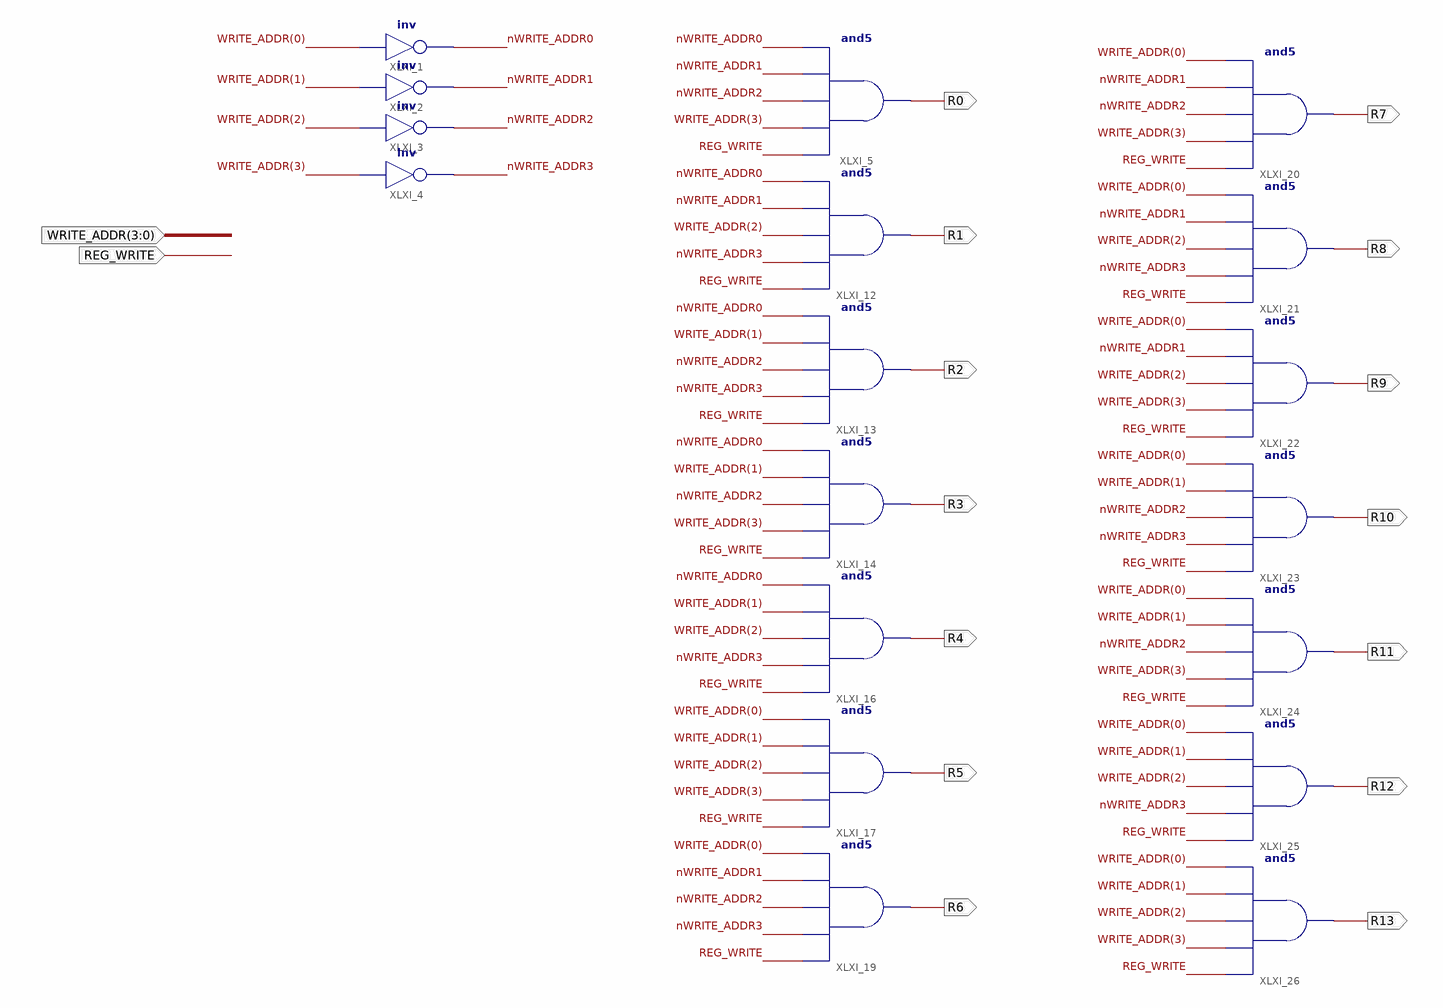
[diagram p0: schematic sheet 1]
// Xilinx ISE schematic RegisterFile_Decoder.sch (spartan3e) as structural Verilog: 18 symbols, 16 ports
module RegisterFile_Decoder (
  input  REG_WRITE,
  input  [3:0] WRITE_ADDR,
  output R0,
  output R1,
  output R2,
  output R3,
  output R4,
  output R5,
  output R6,
  output R7,
  output R8,
  output R9,
  output R10,
  output R11,
  output R12,
  output R13
);

  wire nWRITE_ADDR0, nWRITE_ADDR1, nWRITE_ADDR2, nWRITE_ADDR3;

  not XLXI_1 (nWRITE_ADDR0, WRITE_ADDR[0]);
  not XLXI_2 (nWRITE_ADDR1, WRITE_ADDR[1]);
  not XLXI_3 (nWRITE_ADDR2, WRITE_ADDR[2]);
  not XLXI_4 (nWRITE_ADDR3, WRITE_ADDR[3]);
  and XLXI_5 (R0, REG_WRITE, WRITE_ADDR[3], nWRITE_ADDR2, nWRITE_ADDR1, nWRITE_ADDR0);
  and XLXI_12 (R1, REG_WRITE, nWRITE_ADDR3, WRITE_ADDR[2], nWRITE_ADDR1, nWRITE_ADDR0);
  and XLXI_13 (R2, REG_WRITE, nWRITE_ADDR3, nWRITE_ADDR2, WRITE_ADDR[1], nWRITE_ADDR0);
  and XLXI_14 (R3, REG_WRITE, WRITE_ADDR[3], nWRITE_ADDR2, WRITE_ADDR[1], nWRITE_ADDR0);
  and XLXI_16 (R4, REG_WRITE, nWRITE_ADDR3, WRITE_ADDR[2], WRITE_ADDR[1], nWRITE_ADDR0);
  and XLXI_17 (R5, REG_WRITE, WRITE_ADDR[3], WRITE_ADDR[2], WRITE_ADDR[1], WRITE_ADDR[0]);
  and XLXI_19 (R6, REG_WRITE, nWRITE_ADDR3, nWRITE_ADDR2, nWRITE_ADDR1, WRITE_ADDR[0]);
  and XLXI_20 (R7, REG_WRITE, WRITE_ADDR[3], nWRITE_ADDR2, nWRITE_ADDR1, WRITE_ADDR[0]);
  and XLXI_21 (R8, REG_WRITE, nWRITE_ADDR3, WRITE_ADDR[2], nWRITE_ADDR1, WRITE_ADDR[0]);
  and XLXI_22 (R9, REG_WRITE, WRITE_ADDR[3], WRITE_ADDR[2], nWRITE_ADDR1, WRITE_ADDR[0]);
  and XLXI_23 (R10, REG_WRITE, nWRITE_ADDR3, nWRITE_ADDR2, WRITE_ADDR[1], WRITE_ADDR[0]);
  and XLXI_24 (R11, REG_WRITE, WRITE_ADDR[3], nWRITE_ADDR2, WRITE_ADDR[1], WRITE_ADDR[0]);
  and XLXI_25 (R12, REG_WRITE, nWRITE_ADDR3, WRITE_ADDR[2], WRITE_ADDR[1], WRITE_ADDR[0]);
  and XLXI_26 (R13, REG_WRITE, WRITE_ADDR[3], WRITE_ADDR[2], WRITE_ADDR[1], WRITE_ADDR[0]);
endmodule
